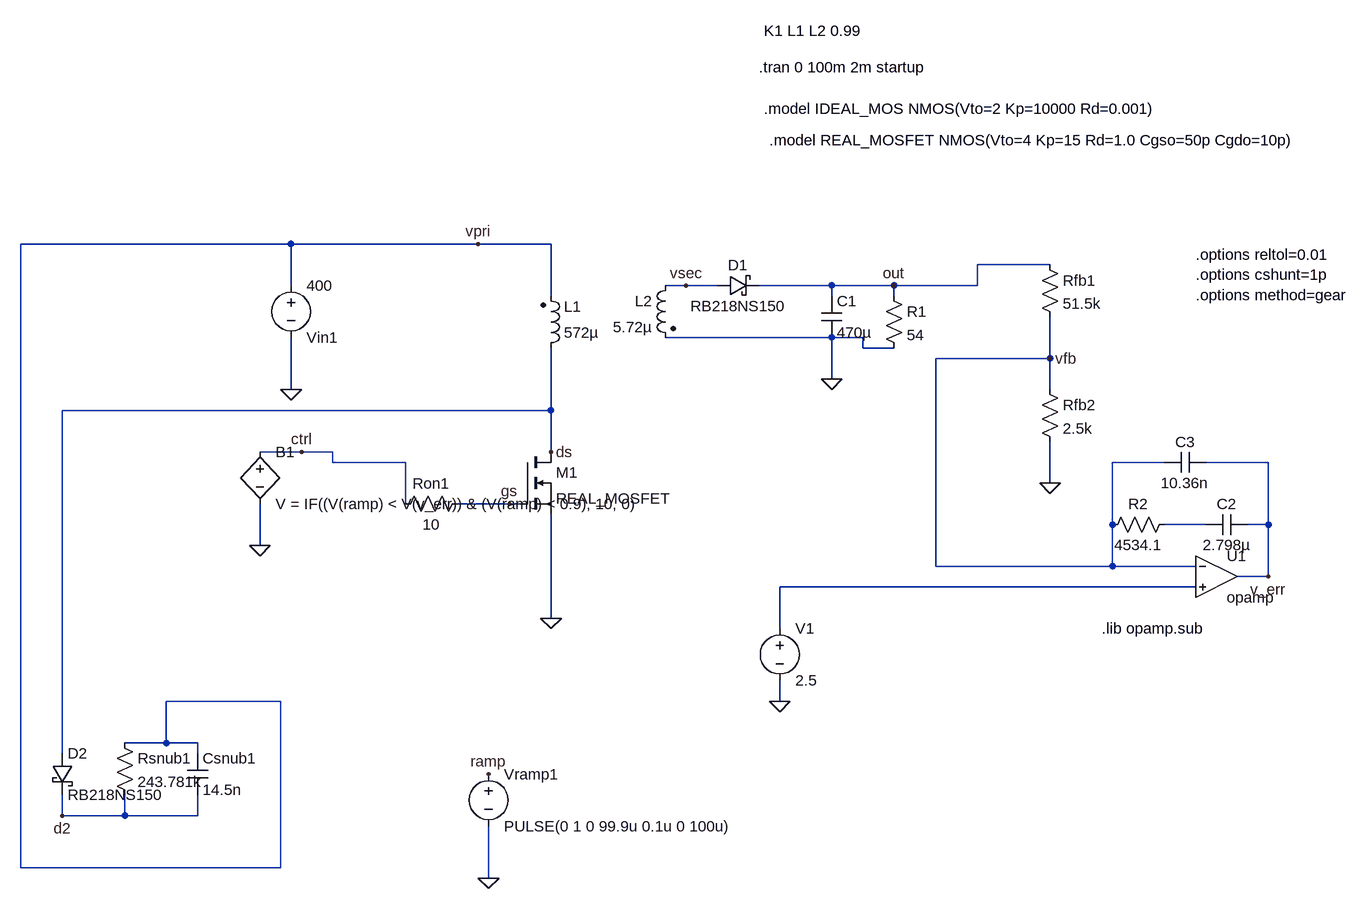
[diagram p0: schematic 11-07-26.asc]
11-07-26.asc, the LTspice schematic file:
Version 4
SHEET 1 1284 852
WIRE -368 -144 -784 -144
WIRE -80 -144 -368 -144
WIRE 32 -144 -80 -144
WIRE 800 -112 688 -112
WIRE -368 -80 -368 -144
WIRE 240 -80 208 -80
WIRE 288 -80 240 -80
WIRE 464 -80 352 -80
WIRE 560 -80 464 -80
WIRE 688 -80 688 -112
WIRE 688 -80 560 -80
WIRE 32 -64 32 -144
WIRE 464 -64 464 -80
WIRE 560 -64 560 -80
WIRE 464 0 208 0
WIRE 512 0 464 0
WIRE 512 16 512 0
WIRE 560 16 512 16
WIRE 800 32 800 -32
WIRE 800 32 624 32
WIRE 464 64 464 0
WIRE -368 80 -368 0
WIRE 800 80 800 32
WIRE 32 112 32 16
WIRE 32 112 -720 112
WIRE -352 176 -416 176
WIRE -304 176 -352 176
WIRE 32 176 32 112
WIRE -304 192 -304 176
WIRE -192 192 -304 192
WIRE 976 192 896 192
WIRE 1136 192 1040 192
WIRE 800 224 800 160
WIRE -192 256 -192 192
WIRE -32 256 -112 256
WIRE -16 256 -32 256
WIRE 896 288 896 192
WIRE 1040 288 976 288
WIRE 1136 288 1136 192
WIRE 1136 288 1104 288
WIRE -416 320 -416 256
WIRE 624 352 624 32
WIRE 896 352 896 288
WIRE 896 352 624 352
WIRE 1024 352 896 352
WIRE 1136 368 1136 288
WIRE 1136 368 1088 368
WIRE 1024 384 384 384
WIRE 32 432 32 272
WIRE 384 448 384 384
WIRE -384 560 -560 560
WIRE 384 560 384 528
WIRE -560 624 -560 560
WIRE -560 624 -624 624
WIRE -512 624 -560 624
WIRE -720 640 -720 112
WIRE -512 640 -512 624
WIRE -720 736 -720 704
WIRE -624 736 -624 704
WIRE -624 736 -720 736
WIRE -512 736 -512 704
WIRE -512 736 -624 736
WIRE -784 816 -784 -144
WIRE -384 816 -384 560
WIRE -384 816 -784 816
WIRE -64 832 -64 752
FLAG 464 64 0
FLAG 32 432 0
FLAG -368 80 0
FLAG 560 -80 out
FLAG -720 736 d2
FLAG -80 -144 vpri
FLAG 240 -80 vsec
FLAG -352 176 ctrl
FLAG -416 320 0
FLAG -32 256 gs
FLAG 32 176 ds
FLAG 800 224 0
FLAG 800 32 vfb
FLAG 384 560 0
FLAG 1136 368 v_err
FLAG -64 832 0
FLAG -64 672 ramp
SYMBOL ind2 16 32 M180
WINDOW 0 36 80 Left 2
WINDOW 3 36 40 Left 2
SYMATTR InstName L1
SYMATTR Value 572µ
SYMATTR Type ind
SYMBOL ind2 224 -96 M0
SYMATTR InstName L2
SYMATTR Value 5.72µ
SYMATTR Type ind
SYMBOL schottky 288 -64 R270
WINDOW 0 32 32 VTop 2
WINDOW 3 0 32 VBottom 2
SYMATTR InstName D1
SYMATTR Value RB218NS150
SYMATTR Description Diode
SYMATTR Type diode
SYMBOL cap 448 -64 R0
SYMATTR InstName C1
SYMATTR Value 470µ
SYMBOL voltage -368 -96 R0
WINDOW 0 24 96 Left 2
WINDOW 3 24 16 Left 2
WINDOW 123 0 0 Left 0
WINDOW 39 0 0 Left 0
SYMATTR InstName Vin1
SYMATTR Value 400
SYMBOL res 544 -80 R0
SYMATTR InstName R1
SYMATTR Value 54
SYMBOL schottky -736 640 R0
SYMATTR InstName D2
SYMATTR Value RB218NS150
SYMATTR Description Diode
SYMATTR Type diode
SYMBOL res -640 608 R0
SYMATTR InstName Rsnub1
SYMATTR Value 243.781k
SYMBOL cap -528 640 R0
SYMATTR InstName Csnub1
SYMATTR Value 14.5n
SYMBOL nmos -16 176 R0
SYMATTR InstName M1
SYMATTR Value REAL_MOSFET
SYMBOL res -96 240 R90
WINDOW 0 0 56 VBottom 2
WINDOW 3 32 56 VTop 2
SYMATTR InstName Ron1
SYMATTR Value 10
SYMBOL res 784 -128 R0
SYMATTR InstName Rfb1
SYMATTR Value 51.5k
SYMBOL res 784 64 R0
SYMATTR InstName Rfb2
SYMATTR Value 2.5k
SYMBOL OpAmps\\opamp 1056 304 R0
SYMATTR InstName U1
SYMBOL voltage 384 432 R0
WINDOW 123 0 0 Left 0
WINDOW 39 0 0 Left 0
SYMATTR InstName V1
SYMATTR Value 2.5
SYMBOL res 992 272 R90
WINDOW 0 0 56 VBottom 2
WINDOW 3 32 56 VTop 2
SYMATTR InstName R2
SYMATTR Value 4534.1
SYMBOL cap 1104 272 R90
WINDOW 0 0 32 VBottom 2
WINDOW 3 32 32 VTop 2
SYMATTR InstName C2
SYMATTR Value 2.798µ
SYMBOL voltage -64 656 R0
WINDOW 123 0 0 Left 0
WINDOW 39 0 0 Left 0
SYMATTR InstName Vramp1
SYMATTR Value PULSE(0 1 0 99.9u 0.1u 0 100u)
SYMBOL bv -416 160 R0
SYMATTR InstName B1
SYMATTR Value V = IF((V(ramp) < V(v_err)) & (V(ramp) < 0.9), 10, 0)
SYMBOL cap 1040 176 R90
WINDOW 0 0 32 VBottom 2
WINDOW 3 32 32 VTop 2
SYMATTR InstName C3
SYMATTR Value 10.36n
TEXT 360 -472 Left 2 !K1 L1 L2 0.99
TEXT 352 -416 Left 2 !.tran 0 100m 2m startup
TEXT 360 -352 Left 2 !.model IDEAL_MOS NMOS(Vto=2 Kp=10000 Rd=0.001)
TEXT 880 448 Left 2 !.lib opamp.sub
TEXT 368 -304 Left 2 !.model REAL_MOSFET NMOS(Vto=4 Kp=15 Rd=1.0 Cgso=50p Cgdo=10p)
TEXT 1024 -128 Left 2 !.options reltol=0.01\n.options cshunt=1p\n.options method=gear

The netlist it stands for:
* 11-07-26.asc
L1 ds vpri 572µ
L2 vsec 0 5.72µ
D1 vsec out RB218NS150
C1 out 0 470µ
Vin1 vpri 0 400
R1 out 0 54
D2 ds d2 RB218NS150
Rsnub1 vpri d2 243.781k
Csnub1 vpri d2 14.5n
M1 ds gs 0 0 REAL_MOSFET
Ron1 gs ctrl 10
Rfb1 out vfb 51.5k
Rfb2 vfb 0 2.5k
XU1 vfb N002 v_err opamp Aol=100K GBW=10Meg  ; pins invin noninvin out
V1 N002 0 2.5
R2 N001 vfb 4534.1
C2 v_err N001 2.798µ
Vramp1 ramp 0 PULSE(0 1 0 99.9u 0.1u 0 100u)
B1 ctrl 0 V = IF((V(ramp) < V(v_err)) & (V(ramp) < 0.9), 10, 0)
C3 v_err vfb 10.36n
.model D D
.lib standard.dio
.model NMOS NMOS
.model PMOS PMOS
.lib standard.mos
K1 L1 L2 0.99
.tran 0 100m 2m startup
.model IDEAL_MOS NMOS(Vto=2 Kp=10000 Rd=0.001)
.lib opamp.sub
.model REAL_MOSFET NMOS(Vto=4 Kp=15 Rd=1.0 Cgso=50p Cgdo=10p)
.options reltol=0.01
.options cshunt=1p
.options method=gear
.backanno
.end